# Altium schematic sheet Pg6-Power supply 1.SchDoc: Isolated Poser Supply 2
size 431 x 279 mm; Date: Not shown in title block; ApprovedBy: Not shown in title block; CheckedBy: Not shown in title block; Author: Not shown in title block; CompanyName: Not shown in title block; Engineer: Not shown in title block; Organization: Not shown in title block; Address1: Not shown in title block; Address2: Not shown in title block; Address3: Not shown in title block; Address4: Not shown in title block; DocumentNumber: 6; Revision: Use project parameter SCH_Rev; SheetNumber: 6; SheetTotal: 9; PageSetup: Record=PageOptions|CenterHorizontal=True|CenterVertical=True|PrintScale=1.00|XCorrection=1.00|YCorrection=1.00|PrintKind=0|BorderSize=5000000|LeftOffset=0|BottomOffset=0|Orientation=2|PaperLength=1000|PaperWidth=1000|Scale=100|PaperSource=15|PrintQuality=600|MediaType=1|DitherType=10|PaperKind=Letter|PrintScaleMode=1; CurrentTime: Not shown in title block; CurrentDate: Not shown in title block; Time: Not shown in title block; DocumentFullPathAndName: Not shown in title block; DocumentName: Not shown in title block; ModifiedDate: Not shown in title block; ImagePath: Not shown in title block
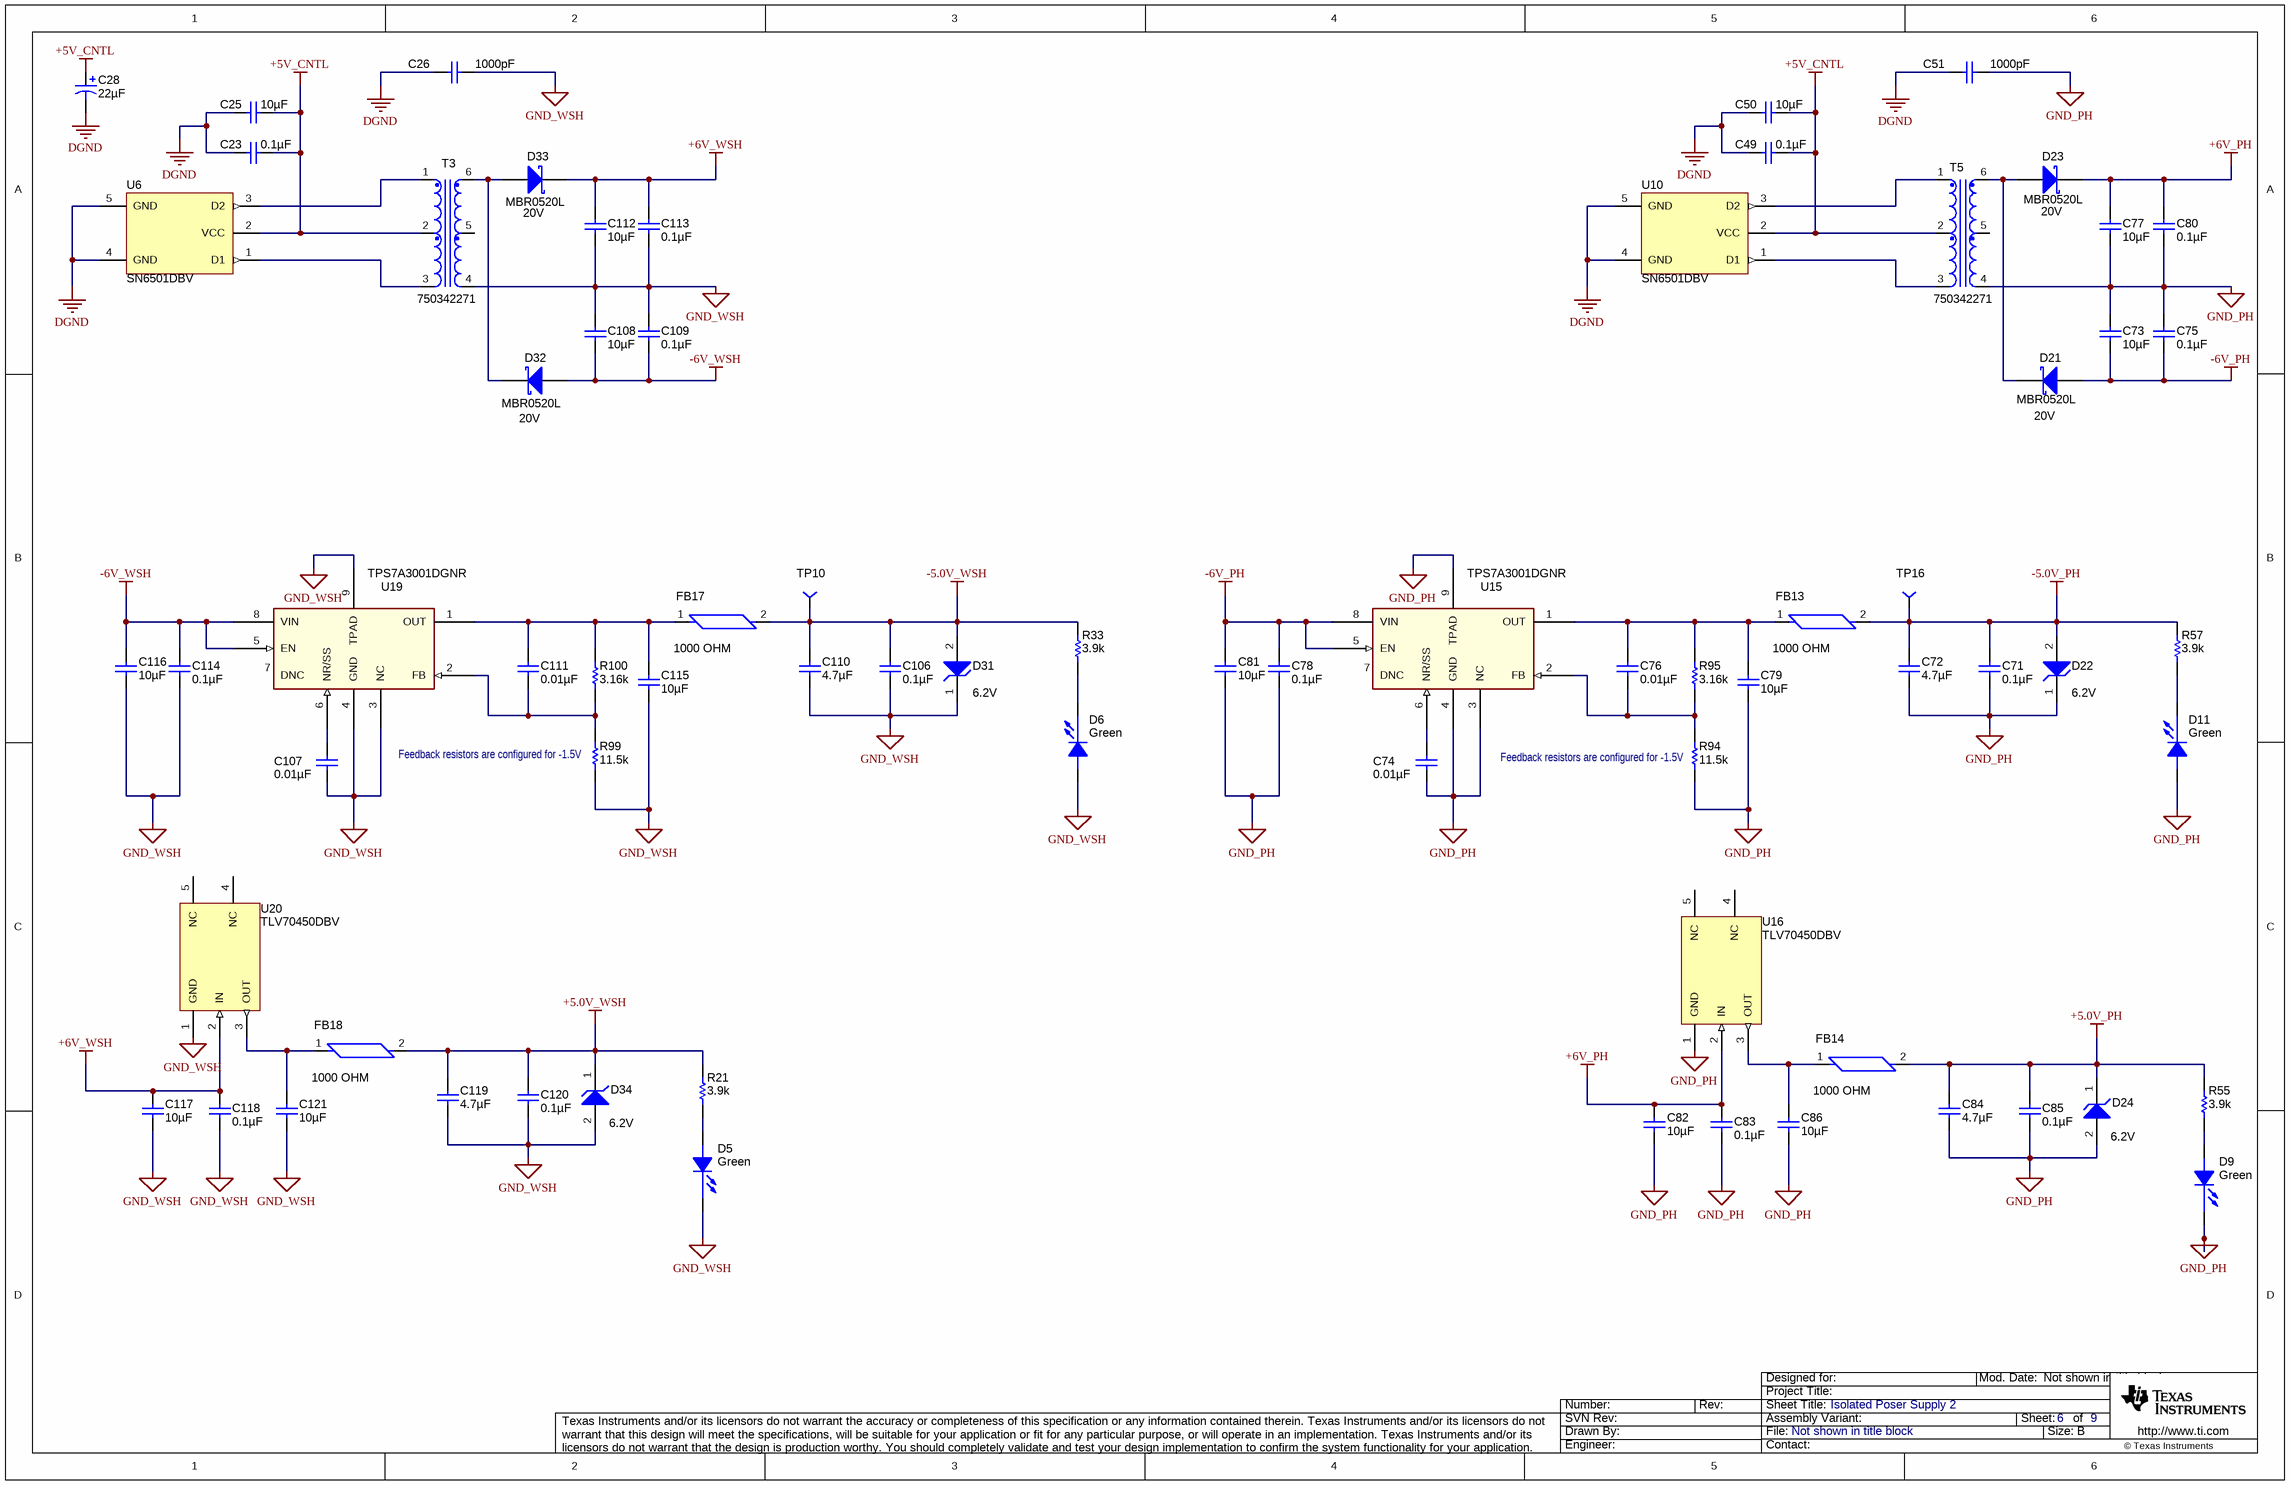
[diagram p0: Pg6-Power supply 1.SchDoc]

## Parts
C23  ValueDisplayed: 0.1µF  [0603]
C25  ValueDisplayed: 10µF  [1210]
C26  value 1000pF  [CAP_200mil]
C28  ValueDisplayed: 22µF  [SM_RADIAL_5MM]  (hidden comment: UUD1E220MCL1GS)
C49  ValueDisplayed: 0.1µF  [0603]
C50  ValueDisplayed: 10µF  [1210]
C51  value 1000pF  [CAP_200mil]
C71  ValueDisplayed: 0.1µF  [0603]
C72  ValueDisplayed: 4.7µF  [0805_HV]
C73  ValueDisplayed: 10µF  [1210]
C74  ValueDisplayed: 0.01µF  [0603]
C75  ValueDisplayed: 0.1µF  [0603]
C76  ValueDisplayed: 0.01µF  [0603]
C77  ValueDisplayed: 10µF  [1210]
C78  ValueDisplayed: 0.1µF  [0603]
C79  ValueDisplayed: 10µF  [1210]
C80  ValueDisplayed: 0.1µF  [0603]
C81  ValueDisplayed: 10µF  [1210]
C82  ValueDisplayed: 10µF  [1210]
C83  ValueDisplayed: 0.1µF  [0603]
C84  ValueDisplayed: 4.7µF  [0805_HV]
C85  ValueDisplayed: 0.1µF  [0603]
C86  ValueDisplayed: 10µF  [1210]
C106  ValueDisplayed: 0.1µF  [0603]
C107  ValueDisplayed: 0.01µF  [0603]
C108  ValueDisplayed: 10µF  [1210]
C109  ValueDisplayed: 0.1µF  [0603]
C110  ValueDisplayed: 4.7µF  [0805_HV]
C111  ValueDisplayed: 0.01µF  [0603]
C112  ValueDisplayed: 10µF  [1210]
C113  ValueDisplayed: 0.1µF  [0603]
C114  ValueDisplayed: 0.1µF  [0603]
C115  ValueDisplayed: 10µF  [1210]
C116  ValueDisplayed: 10µF  [1210]
C117  ValueDisplayed: 10µF  [1210]
C118  ValueDisplayed: 0.1µF  [0603]
C119  ValueDisplayed: 4.7µF  [0805_HV]
C120  ValueDisplayed: 0.1µF  [0603]
C121  ValueDisplayed: 10µF  [1210]
D5  value Green  [LED0603AA]
D6  value Green  [LED0603AA]
D9  value Green  [LED0603AA]
D11  value Green  [LED0603AA]
D21  MBR0520L  value 20V  [SOD-123]
D22  value 6.2V  [powerDI123]
D23  MBR0520L  value 20V  [SOD-123]
D24  value 6.2V  [powerDI123]
D31  value 6.2V  [powerDI123]
D32  MBR0520L  value 20V  [SOD-123]
D33  MBR0520L  value 20V  [SOD-123]
D34  value 6.2V  [powerDI123]
FB13  value 1000 OHM  [FB0603]
FB14  value 1000 OHM  [FB0603]
FB17  value 1000 OHM  [FB0603]
FB18  value 1000 OHM  [FB0603]
R21  value 3.9k  [0603]
R33  value 3.9k  [0603]
R55  value 3.9k  [0603]
R57  value 3.9k  [0603]
R94  value 11.5k  [0603]
R95  ValueDisplayed: 3.16k  [0603]  (hidden comment: RC0603FR-073K16L)
R99  value 11.5k  [0603]
R100  ValueDisplayed: 3.16k  [0603]  (hidden comment: RC0603FR-073K16L)
T3  750342271  [760390015]
T5  750342271  [760390015]
TP10  (no value)  [TP-040_RND]
TP16  (no value)  [TP-040_RND]
U6  SN6501DBV  [DBV0005A_N]
U10  SN6501DBV  [DBV0005A_N]
U15  (no value)  [MSOP8(DGN)]
U16  TLV70450DBV  [DBV0005A_N]
U19  (no value)  [MSOP8(DGN)]
U20  TLV70450DBV  [DBV0005A_N]

## Nets
+5.0V_PH: C84.2 C85.1 D24.1(K) FB14.2 R55.2
+5.0V_WSH: C119.2 C120.1 D34.1(K) FB18.2 R21.2
+5V_CNTL: C23.2 C25.2 C28.1(+) C49.2 C50.2 T3.2 T5.2 U6.2(VCC) U10.2(VCC)
+6V_PH: C77.1 C80.1 C82.2 C83.1 D23.1(K) U16.2(IN)
+6V_WSH: C112.1 C113.1 C117.2 C118.1 D33.1(K) U20.2(IN)
-5.0V_PH: C71.1 C72.2 D22.2(A) FB13.2 R57.2 TP16.1
-5.0V_WSH: C106.1 C110.2 D31.2(A) FB17.2 R33.2 TP10.1
-6V_PH: C73.2 C75.2 C78.1 C81.2 D21.2(A) U15.5(EN) U15.8(VIN)
-6V_WSH: C108.2 C109.2 C114.1 C116.2 D32.2(A) U19.5(EN) U19.8(VIN)
DGND: C23.1 C25.1 C26.1 C28.2(-) C49.1 C50.1 C51.1 U6.4(GND) U6.5(GND) U10.4(GND) U10.5(GND)
GND_PH: C51.2 C71.2 C72.1 C73.1 C74.1 C75.1 C77.2 C78.2 C79.1 C80.2 C81.1 C82.1 C83.2 C84.1 C85.2 C86.1 D9.1(C) D11.2(A) D22.1(K) D24.2(A) R94.1 T5.4 U15.3(NC) U15.4(GND) U15.9(TPAD) U16.1(GND)
GND_WSH: C26.2 C106.2 C107.1 C108.1 C109.1 C110.1 C112.2 C113.2 C114.2 C115.1 C116.1 C117.1 C118.2 C119.1 C120.2 C121.1 D5.1(C) D6.2(A) D31.1(K) D34.2(A) R99.1 T3.4 U19.3(NC) U19.4(GND) U19.9(TPAD) U20.1(GND)
NetC74_2: C74.2 U15.6(NR/SS)
NetC76_1: C76.1 C79.2 FB13.1 R95.2 U15.1(OUT)
NetC76_2: C76.2 R94.2 R95.1 U15.2(FB)
NetC86_2: C86.2 FB14.1 U16.3(OUT)
NetC107_2: C107.2 U19.6(NR/SS)
NetC111_1: C111.1 R99.2 R100.1 U19.2(FB)
NetC111_2: C111.2 C115.2 FB17.1 R100.2 U19.1(OUT)
NetC121_2: C121.2 FB18.1 U20.3(OUT)
NetD5_2: D5.2(A) R21.1
NetD6_1: D6.1(C) R33.1
NetD9_2: D9.2(A) R55.1
NetD11_1: D11.1(C) R57.1
NetD21_1: D21.1(K) D23.2(A) T5.6
NetD32_1: D32.1(K) D33.2(A) T3.6
NetT3_1: T3.1 U6.3(D2)
NetT3_3: T3.3 U6.1(D1)
NetT5_1: T5.1 U10.3(D2)
NetT5_3: T5.3 U10.1(D1)

Not connected (* = marked no-connect by the designer): T3 5; T5 5; U15 7(DNC); U16 4(NC) 5(NC); U19 7(DNC); U20 4(NC) 5(NC)

## Notes on the sheet
- (near R99) Feedback resistors are configured for -1.5V
- (near R94) Feedback resistors are configured for -1.5V
- Drawn By:
- SVN Rev:
- Number:
- Rev:
- Sheet Title:
- File:
- Project Title:
- Designed for:
- Assembly Variant:
- Mod. Date:
- Sheet:
- Size:
- of
- B
- http://www.ti.com
- Texas Instruments and/or its licensors do not warrant the accuracy or completeness of this specification or any information contained therein. Texas Instruments and/or its licensors do not warrant that this design will meet the specifications, will be suitable for your application or fit for any particular purpose, or will operate in an implementation. Texas Instruments and/or its licensors do not warrant that the design is production worthy. You should completely validate and test your design implementation to confirm the system functionality for your application.
- Engineer:
- Contact:
- © Texas Instruments

## Library data of the parts
C23 C49 C71 C75 C78 C80 C83 C85 C106 C109 C113 C114 C118 C120 = C0603C104K5RACTU: CAP, CERM, 0.1uF, 50V, +/-10%, X7R, 0603; Manufacturer: Kemet; Polarized: N; CompType: Capacitor; U/M: EA; Cap_F: 0.0000001; Tolerance_%: 10; Value1: Unknown; VDC_V: 50; TaMin_C: -55; TaMax_C: 125; SymbolVersion: 2008-07-09; Value: 0.1uF; PartNumber: C0603C104K5RACTU; PackageReference: 0603; RoHS: Y; Value2: 50V; MountType: SMT; Technology: Ceramic; TempCo: X7R; Cap_Case: 0603; Published: 2008-06-19; Publisher: Texas Instruments; LatestRevisionDate: 2013-12-06; ComponentLink1Description: Datasheet link; ComponentLink1URL: http://www.kemet.com/kemet/web/homepage/kechome.nsf/vapubfiles/F3102_Y5V.pdf/$file/F3102_Y5V.pdf; Supplier 1: Digi-Key; Supplier Part Number 1: 399-5089-1-ND; Supplier 2: Mouser; Supplier Part Number 2: 80-C0603C104K5R; Supplier 3: Farnell; Supplier Part Number 3: 1288255
C25 C50 C73 C77 C79 C81 C82 C86 C108 C112 C115-C117 C121 = GMK325AB7106MM-T: CAP, CERM, 10uF, 35V, +/-20%, X7R, 1210; Manufacturer: Taiyo Yuden; Polarized: N; CompType: Capacitor; U/M: EA; Cap_F: 0.00001; Tolerance_%: 20; Value1: Unknown; VDC_V: 35; TaMin_C: -55; TaMax_C: 125; PackageReference: 1210; PartNumber: GMK325AB7106MM-T; SymbolVersion: 2008-07-09; Value: 10uF; RoHS: Y; Value2: 35V; MountType: SMT; Technology: Ceramic; Cap_Case: 1210; Publisher: Texas Instruments; LatestRevisionDate: 2013-12-06; ComponentLink1Description: Datasheet link; ComponentLink1URL: http://www.yuden.co.jp/productdata/catalog/en/mlcc01_e.pdf; Supplier 1: Digi-Key; Supplier Part Number 1: 587-2779-1-ND; Supplier 2: Mouser; Supplier Part Number 2: 963-GMK325AB7106MM-T; Supplier 3: Farnell; Supplier Part Number 3: 1894510; TempCo: X7R; Published: 2008-06-19
C26 C51 = 202R18W102KV4E: CAP CER 1000PF 1KV 10% RADIAL; PartNumber: S102K29Y5PN63J5R; Manufacturer: Vishay BC Components; Polarized: N; CompType: Capacitor; Tolerance_%: 0; ValueDisplayed: 1000pF; RoHS: Y; Value2: 1kv; MountType: radial; Technology: Ceramic; Publisher: Texas Instruments; ComponentLink1Description: Datasheet link; ComponentLink1URL: http://www.johansondielectrics.com/images/stories/catalog/JDI-Product-Catalog.pdf; Supplier 1: Digi-Key; Supplier Part Number 1: 1251PH-ND
C28 = UUD1E220MCL1GS: CAP, AL, 22uF, 25V, +/-20%, 0.76 ohm, SMD; Manufacturer: Nichicon; Polarized: Y; CompType: Capacitor; U/M: EA; Cap_F: 0.000022; Tolerance_%: 20; VDC_V: 25; ESR_Ohm: 0.76; IRMS_A: 0.15; TaMin_C: -55; TaMax_C: 105; Cap_Case: 5x5.8; SymbolVersion: 2008-07-09; Value: 22uF; PartNumber: UUD1E220MCL1GS; PackageReference: 5x5.8; RoHS: Y; Value1: 0.76 ohm; Value2: 25V; MountType: SMT; Technology: AL; Series: uD; Publisher: Texas Instruments; LatestRevisionDate: 2014-01-08; ComponentLink1Description: Datasheet link; ComponentLink1URL: http://products.nichicon.co.jp/en/pdf/XJA043/e-ud.pdf; Supplier 1: Digi-Key; Supplier Part Number 1: 493-2270-1-ND; Supplier 2: Mouser; Supplier Part Number 2: 647-UUD1E220MCL; Supplier 3: Farnell; Supplier Part Number 3: 1899607
C72 C84 C110 C119 = C2012X5R1H475K125AB: CAP, CERM, 4.7uF, 50V, +/-10%, X5R, 0805; Manufacturer: TDK; Polarized: N; CompType: Capacitor; U/M: EA; Cap_F: 0.0000047; Tolerance_%: 10; Value1: Unknown; VDC_V: 50; TaMin_C: -55; TaMax_C: 85; Cap_Case: 0805; PackageReference: 0805; PartNumber: C2012X5R1H475K125AB; SymbolVersion: 2008-07-09; Value: 4.7uF; RoHS: Y; Value2: 50V; MountType: SMT; Technology: Ceramic; Publisher: Texas Instruments; LatestRevisionDate: 2013-12-06; ComponentLink1Description: Datasheet link; ComponentLink1URL: http://product.tdk.com/capacitor/mlcc/en/productguide/pdf/mlcc_selection_guide_en_03.pdf; Supplier 1: Digi-Key; Supplier Part Number 1: 445-5980-1-ND; TempCo: X5R; Published: 2008-06-19
C74 C76 C107 C111 = 06031C103JAT2A: CAP, CERM, 0.01uF, 100V, +/-5%, X7R, 0603; Manufacturer: AVX; Polarized: N; CompType: Capacitor; U/M: EA; Cap_F: 0.00000001; Tolerance_%: 5; ESR_Ohm: 0.098; Value1: 0.098 ohm; VDC_V: 100; TaMin_C: -55; TaMax_C: 125; SymbolVersion: 2008-07-09; Value: 0.01uF; PartNumber: 06031C103J4Z4A; PackageReference: 0603; RoHS: Y; Value2: 100V; MountType: SMT; Technology: Ceramic; TempCo: X7R; Cap_Case: 0603; Published: 2008-06-19; Publisher: Texas Instruments; LatestRevisionDate: 2013-11-21; ComponentLink1Description: Datasheet link; ComponentLink1URL: http://www.avx.com/docs/masterpubs/smccp.pdf; Supplier 1: Digi-Key; Supplier Part Number 1: 478-7418-1-ND; Supplier 2: Mouser; Supplier Part Number 2: 581-06031C103J; Supplier 3: Farnell; Supplier Part Number 3: 1833876
D5 D6 D9 D11 = LED_LG L29K-G2J1-24-Z: LED SmartLED Green 570NM; Manufacturer: OSRAM; SymbolCreator: x0120606; CompType: *; PartNumber: LG L29K-G2J1-24-Z; Alternate Manufacturer: LED; PackageReference: 0603; ComponentLink1URL: http://catalog.osram-os.com/catalogue/catalogue.do;jsessionid=32CB61882C089EDD4B6D0A54E7E1F117?act=downloadFile&favOid=020000020000138e000100b6; Alternate PartNumber: *; ComponentLink1Description: Datasheet link; Supplier Part Number 1: 475-2709-2-ND; Supplier 1: Digi-Key; MountType: SMT; Publisher: TI
D21 D23 D32 D33 = MBR0520LT1G: Diode, Schottky, 20V, 0.5A, SOD-123; Manufacturer: Fairchild Semiconductor; U/M: EA; Vf_V: 0.385; Value2: 0.385V; Io_A: 0.5; Vr_V: 20; TJmax_C: 125; RJC_CperW: 150; CompType: Diode; SymbolVersion: 2008-12-08; PartNumber: MBR0520L; PackageReference: SOD-123; Value1: 0.5A; MountType: SMT; Type: Schottky; RoHS: Y; Published: 2008-06-26; Publisher: Texas Instruments; LatestRevisionDate: 2013-12-18; ComponentLink1Description: Datasheet link; ComponentLink1URL: http://www.onsemi.com/pub_link/Collateral/MBR0520LT1-D.PDF; Supplier 1: Digi-Key; Supplier Part Number 1: MBR0520LCT-ND; Supplier 2: Mouser; Supplier Part Number 2: 863-MBR0520LT1G; Supplier 3: Farnell; Supplier Part Number 3: 9556915
D22 D24 D31 D34 = DFLZ6V2-7: Diode, Zener, 6.2V, 1W, PowerDI123; Manufacturer: Diodes Inc.; U/M: EA; Power_W: 1; Vz_V: 6.2; RJA_CperW: 110; CompType: Zener; SymbolVersion: 2010-08-25; PartNumber: DFLZ6V2-7; PackageReference: PowerDI123; Vr_V: N/A; Value1: 1W; MountType: SMT; RoHS: Y; ComponentLink1Description: Datasheet link; ComponentLink1URL: http://www.diodes.com/datasheets/ds30464.pdf; Published: 2008-10-08; Publisher: Texas Instruments; LatestRevisionDate: 2013-11-26; LatestRevisionNote: Updated Supplier Data; Supplier 1: Digi-Key; Supplier Part Number 1: DFLZ6V2DICT-ND; Supplier 2: Mouser; Supplier Part Number 2: 621-DFLZ6V2-7; Supplier 3: Farnell; Supplier Part Number 3: 2077983
FB13 FB14 FB17 FB18 = MMZ1608B102C: FERRITE CHIP 1000 OHM 300MA 0603; Manufacturer: TDK Corporation; CompType: Ferrite Bead; PartNumber: MMZ1608B102C; MountType: SMT; Alternate PartNumber: *; Supplier 1: Digi-Key; ComponentLink1URL: http://www.tdk.co.jp/tefe02/e9412_mmz.pdf; ComponentLink1Description: Datasheet link; Publisher: TI; Supplier Part Number 1: 445-8672-1-ND; PackageReference: 0603; Alternate Manufacturer: *; RoHS: Y
R21 R33 R55 R57 = CRCW06033K90JNEA: RES, 3.9k ohm, 5%, 0.1W, 0603; Manufacturer: Vishay-Dale; CompType: Resistor; Res_ohm: 3900; Value_Code: 3k90; Tolerance_%: 5; Power_W: 0.1; VDC_V: 75; TempCo: 200 ppm/C; EIA_Code: E24; U/M: EA; SymbolVersion: 2009-05-29; PartNumber: CRCW06033K90JNEA; PackageReference: 0603; RoHS: Y; Value1: 5%; Value2: 0.1W; MountType: SMT; Technology: Thick Film; Published: 2008-06-26; Publisher: Texas Instruments; LatestRevisionDate: 2013-10-22; ComponentLink1Description: Datasheet link; ComponentLink1URL: http://www.vishay.com/docs/20035/dcrcwe3.pdf; Supplier 1: Digi-Key; Supplier Part Number 1: 541-3.9KGCT-ND; Supplier 2: Farnell; Supplier Part Number 2: 1563917; Supplier 3: Newark; Supplier Part Number 3: 72M6834
R94 R99 = CRCW060311K5FKEA: RES, 11.5k ohm, 1%, 0.1W, 0603; Manufacturer: Vishay-Dale; CompType: Resistor; Res_ohm: 11500; Value_Code: 11k5; Tolerance_%: 1; Power_W: 0.1; VDC_V: 75; TempCo: 100 ppm/C; EIA_Code: E96; U/M: EA; SymbolVersion: 2009-05-29; PartNumber: CRCW060311K5FKEA; PackageReference: 0603; RoHS: Y; Value1: 1%; Value2: 0.1W; MountType: SMT; Technology: Thick Film; Published: 2008-06-26; Publisher: Texas Instruments; LatestRevisionDate: 2013-10-22; ComponentLink1Description: Datasheet link; ComponentLink1URL: http://www.vishay.com/docs/20035/dcrcwe3.pdf; Supplier 1: Digi-Key; Supplier Part Number 1: 541-11.5KHCT-ND; Supplier 2: Mouser; Supplier Part Number 2: 71-CRCW0603-11.5K-E3; Supplier 3: Farnell; Supplier Part Number 3: 1469753
R95 R100 = RC0603FR-073K16L: RES, 3.16 k, 1%, 0.1 W, 0603; Manufacturer: Yageo America; CompType: Resistor; Value: 3.16k; Res_ohm: 3160; Value_Code: 3k16; Tolerance_%: 1; Power_W: 0.1; Value2: 0.1W; VDC_V: 150; TempCo: 200 ppm/C; EIA_Code: E96; U/M: EA; SymbolVersion: 2009-05-29; PartNumber: RC0603FR-073K16L; PackageReference: 0603; RoHS: Y; Value1: 1%; MountType: SMT; Technology: Thick Film; Published: 2008-06-26; Publisher: Texas Instruments; LatestRevisionDate: 2015-08-12; ComponentLink1Description: Datasheet link; ComponentLink1URL: http://www.yageo.com/pdf/Pu-RC0603_51_PbFree_L_2.pdf; Supplier 1: Digi-Key; Supplier Part Number 1: 311-3.16KHRCT-ND; Supplier 2: Mouser; Supplier Part Number 2: 603-RC0603FR-073K16L; Supplier 3: Farnell; Supplier Part Number 3: 9238549
T3 T5 = TRNSFMR: Transformer 469uH SMD; Manufacturer: Wurth Electronics Midcom; Alternate Manufacturer: *; RoHS: Y; Value: 469uH; MountType: SMT; PartNumber: 750342271; PackageReference: 10.05mm L x 6.73mm W; Publisher: TI; ComponentLink1Description: Datasheet Link; Alternate PartNumber: *; CompType: Transformer; Supplier 1: Digi-Key
TP10 TP16 = TP-040_RND: Test Point, O.040 Hole; Manufacturer: STD; Value: STD; area: *; SymbolVersion: 06/30/2008 16:03:57; PartNumber: STD; ComponentLink1Description: AEO Datasheet Link
U6 U10 = SN6501DBV: Transformer Driver for Isolated Power Supplies, DBV0005A; Alternate Manufacturer: None; Manufacturer: Texas Instruments; SymbolCreator: a0411947; CompType: IC; U/M: EA; SymbolVersion: 2013-06-28; PartNumber: SN6501DBV; PackageReference: DBV0005A; MountType: SMT; ComponentLink1Description: Datasheet Link; ComponentLink1URL: http://www.ti.com/lit/ds/symlink/sn6501.pdf; RoHS: Y; Publisher: Texas Instruments; LatestRevisionDate: 2013-12-23
U15 U19 = TPS7A3001DGNR: -36V, -200mA, Ultralow-Noise, Negative Linear Regulator; Alternate Manufacturer: None; Manufacturer: Texas Instruments; CompType: IC; SymbolCreator: x0120606; ComponentLink1URL: http://www.ti.com/lit/ds/symlink/tps7a3001.pdf; ComponentLink1Description: Datasheet Link; Publisher: Texas Instruments; PackageReference: MSOP-PowerPAD (DGN) | 8; RoHS: Y; PartNumber: TPS7A3001DGNR; MountType: SMT
U16 U20 = TLV70450DBV: Regulator, LDO, 5V, 0.15A, SOT23-5; Alternate Manufacturer: None; Manufacturer: Texas Instruments; SymbolCreator: x0120606; CompType: IC; PartNumber: TLV70450DBV; PackageReference: DBV0005A; MountType: SMT; ComponentLink1Description: Datasheet Link; ComponentLink1URL: http://www.ti.com/lit/ds/symlink/tlv70450.pdf; RoHS: Y; Publisher: Texas Instruments